# Altium schematic sheet LM2596-5V-BuckConverter-copy_2024-10-14.schdoc
size 91 x 53 mm
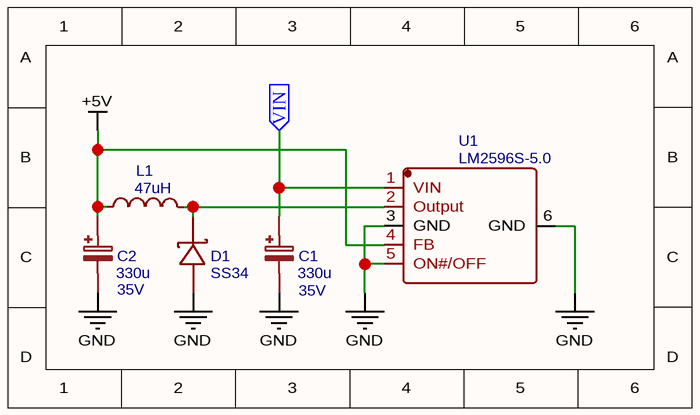
[diagram p0: LM2596-5V-BuckConverter-copy_2024-10-14.schdoc]

## Parts
C1  330u  [CAP-D8.0XH10.5]
C2  330u  [CAP-D8.0XH10.5]
D1  SS34  [SMA(DO-214AC)]
L1  47uH  [IND-SMD_L12.0-W12.0_CDRH127NP]
U1  LM2596S-5.0  [TO-263-5_L10.6-W9.6-P1.70-LS15.9-BR]

## Ports
VIN (in)

## Nets
+5V: C2.1 L1.1 U1.4(FB)
GND: C1.2 C2.2 D1.1(A) U1.3(GND) U1.5(ON#/OFF) U1.6(GND)
VIN: C1.1 U1.1(VIN) ; port VIN
NetD1_2: D1.2(K) L1.2 U1.2(Output)

## Notes on the sheet
- (near C2) 35V
- (near C1) 35V

## Library data of the parts
C1 C2 = 330u: nameAlias: Value(F); Contributor: EasyEDA; Manufacturer Part: ?; spicePre: C; spiceSymbolName: Cap_Electrolytic(SMD)_D8.0XH10.5_EU
D1 = SS34: Manufacturer: Yenji; Contributor: LCSC; SMT Type: Extend; Supplier: LCSC; Manufacturer Part: SS34; Supplier Part: C142458; LCSC Assembly: Yes; spicePre: D
L1 = 47uH: Manufacturer: Sumida; Manufacturer Part: CDRH127NP-470MC; nameAlias: Inductance; Contributor: LCSC; Supplier: LCSC; Supplier Part: C167265; spicePre: L; spiceSymbolName: CDRH127NP-470MC
U1 = LM2596S-5.0: Manufacturer: Texas Instruments; Manufacturer Part: LM2596S-5.0/NOPB; Contributor: LCSC; Supplier: LCSC; Supplier Part: C116713; spicePre: U